# EAGLE design HelloBoardFinal (EAGLE 9.6.2)
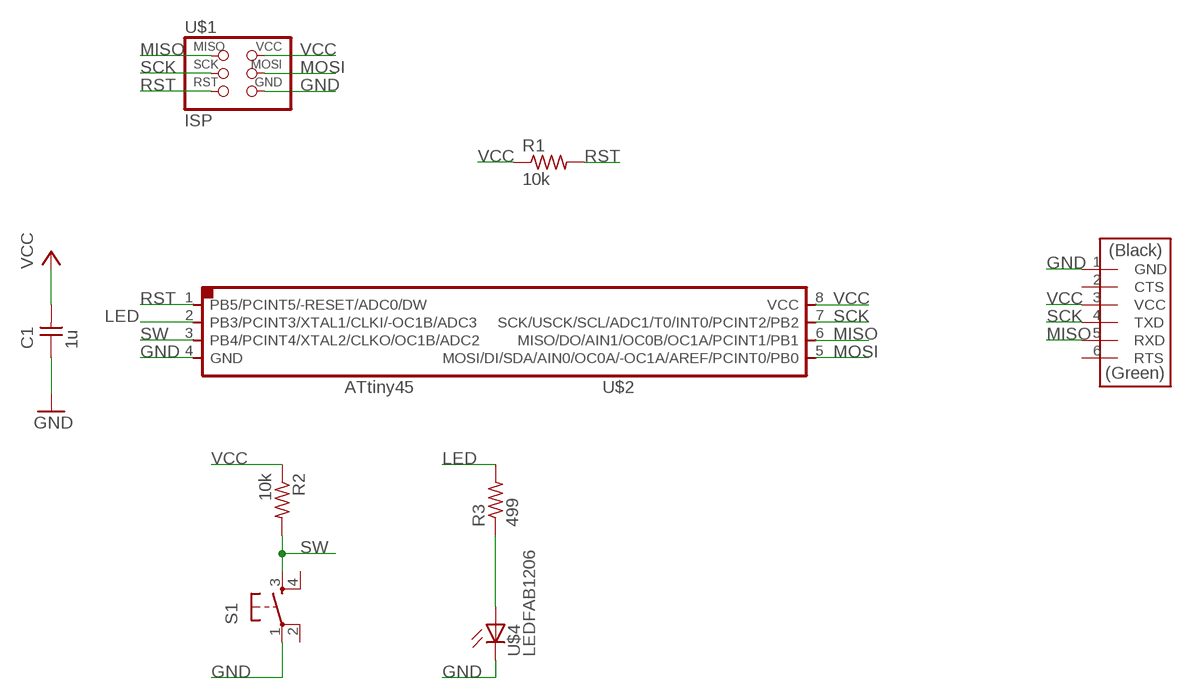
[diagram p0: schematic, sheet 1]

## Parts
C1  1u  CAP_UNPOLARIZEDFAB  [C1206FAB]
R1  10k  R1206FAB  [R1206FAB]
R2  10k  R1206FAB  [R1206FAB]
R3  499  R1206FAB  [R1206FAB]
S1  SW_SWITCH_TACTILE_6MM6MM_SWITCH  [6MM_SWITCH]
U$1  ISP  CONN_03X2_AVRISPSMD  [2X03SMD]
U$2  AT45  UC_ATTINY45SI  [SOIC8]
U$3  CONN_06_FTDI-SMD-HEADER  [1X06SMD]
U$4  LEDFAB1206  [LED1206FAB]

## Nets
GND: C1.1 S1.1(P) U$1.6(GND) U$2.4(GND) U$3.1(GND) U$4.2(C)
LED: R3.2 U$2.2(PB3/PCINT3/XTAL1/CLKI/-OC1B/ADC3)
MISO: U$1.1(MISO) U$2.6(MISO/DO/AIN1/OC0B/OC1A/PCINT1/PB1) U$3.5(RXD)
MOSI: U$1.4(MOSI) U$2.5(MOSI/DI/SDA/AIN0/OC0A/-OC1A/AREF/PCINT0/PB0)
N$2: R3.1 U$4.1(A)
RST: R1.2 U$1.5(RST) U$2.1(PB5/PCINT5/-RESET/ADC0/DW)
SCK: U$1.3(SCK) U$2.7(SCK/USCK/SCL/ADC1/T0/INT0/PCINT2/PB2) U$3.4(TXD)
SW: R2.2 S1.3(S) U$2.3(PB4/PCINT4/XTAL2/CLKO/OC1B/ADC2)
VCC: C1.2 R1.1 R2.1 U$1.2(VCC) U$2.8(VCC) U$3.3(VCC)
Unconnected: S1.2(P1) S1.4(S1) U$3.2(CTS) U$3.6(RTS)

## Library data of the parts
C1 = 00fab:CAP_UNPOLARIZED
R1-R3 = 00fab:R: Resistor (US Symbol) Variants with postfix FAB are widened to allow the routing of internal traces
S1 = 00fab:SW_SWITCH_TACTILE_6MM: OMRON SWITCH
U$1 = 00fab:CONN_03X2_AVRISP
U$2 = 00fab:UC_ATTINY45
U$3 = 00fab:CONN_06_FTDI-SMD-HEADER
U$4 = 00fab:LED: LED

## Board
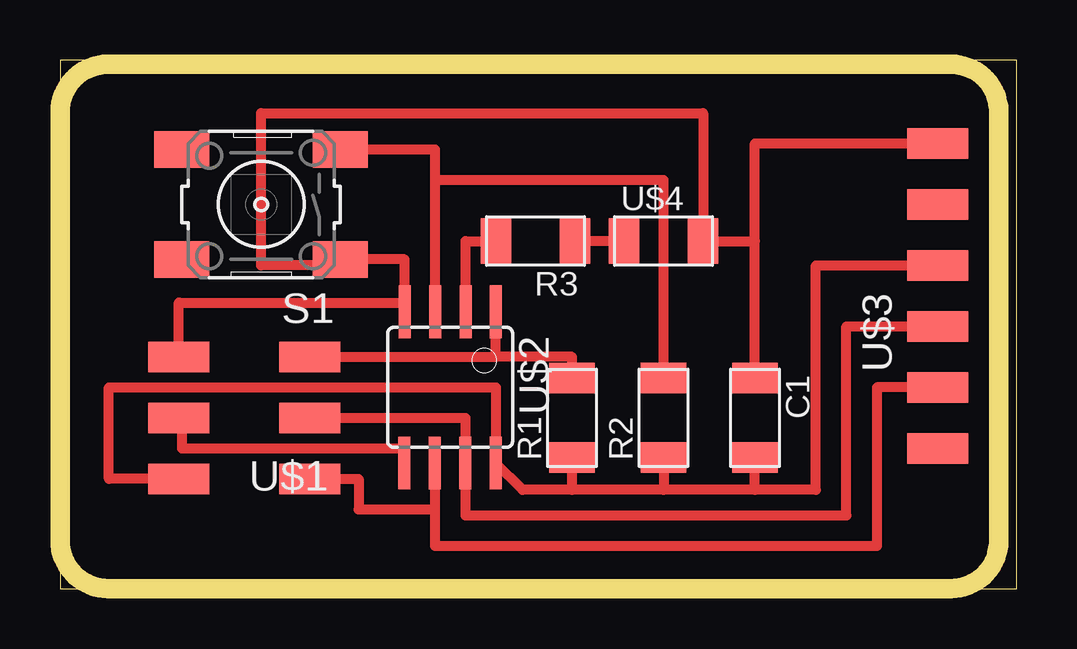
[diagram p1: board, top side]

Size 39.86 x 22.02 mm. Coordinates in mm from the lower left corner, seen from the top.
Outline: 0,0 39.86,0 39.86,22.02 0,22.02 0,0
Copper layers (1*16): Top 0.035mm / dielectric 1.5mm / Bottom 0.035mm
Design rules "default *": minimum track width 16mil, minimum drill 0.35mm, track to track 16mil, track to pad 16mil, pad to pad 16mil, via to via 16mil, smd to smd 10mil, copper to edge 40mil, drill to drill 6mil, minimum pad ring 10mil, minimum via ring 8mil, stop-mask expansion 4mil, vias tented up to drill 0mil, thermal gap 10mil
Milling: 8 lines

### Footprints (pad centres in the part's own frame; a part is rotated, then mirrored left to right if it is on the bottom)
C1206FAB = smd 1.27 x 1.905: 1 -1.651,0; 2 1.651,0
R1206FAB = smd 1.27 x 1.905: 1 -1.651,0; 2 1.651,0
6MM_SWITCH = smd 2.286 x 1.524: 1 -3.302,2.286; 2 3.302,2.286; 3 -3.302,-2.286; 4 3.302,-2.286
2X03SMD = smd 2.54 x 1.27: 1 -2.54,2.54; 2 2.92,2.54; 3 -2.54,0; 4 2.92,0; 5 -2.54,-2.54; 6 2.92,-2.54
SOIC8 = smd 0.5 x 2.2: 1 -1.905,-3.154; 2 -0.645,-3.154; 3 0.625,-3.154; 4 1.895,-3.154; 5 1.905,3.154; 6 0.635,3.154; 7 -0.635,3.154; 8 -1.905,3.154
1X06SMD = smd 2.54 x 1.27: 1 0,6.35; 2 0,3.81; 3 0,1.27; 4 0,-1.27; 5 0,-3.81; 6 0,-6.35
LED1206FAB = smd 1.27 x 1.905: 1 -1.651,0; 2 1.651,0

### Placement (x,y rotation side)
C1  28.96,7.11 270 top
R1  21.34,7.11 90 top
R2  25.15,7.11 90 top
R3  19.81,14.48 180 top
S1  8.38,16 180 top
U$1  7.87,7.11 180 top
U$2  16.26,8.38 180 top
U$3  36.58,12.19 0 top
U$4  25.15,14.48 0 top

### Tracks (layer width: path | path; a pad name or v marks a point on that pad's centre or on a via)
GND
  Top 0.406: U$1.6 4.95,11.91 14.36,11.91 U$2.4 14.36,13.72 S1.1 11.68,13.46 8.38,13.46 8.38,19.81 26.8,19.81 U$4.2 28.96,14.48 | C1.1 28.96,14.48 | 28.96,14.48 28.96,18.54 U$3.1
LED
  Top 0.406: R3.2 16.9,14.48 U$2.2
MISO
  Top 0.406: U$3.5 34.04,8.38 34.04,1.78 15.62,1.78 15.62,3.3 | U$1.1 12.45,4.57 12.45,3.3 15.62,3.3 | U$2.6 15.62,3.3
MOSI
  Top 0.406: U$2.5 14.35,5.84 5.08,5.84 5.08,6.99 U$1.4
N$2
  Top 0.406: U$4.1 R3.1
RST
  Top 0.406: U$1.5 18.16,9.65 | 18.16,9.65 U$2.1 | R1.2 21.34,9.65 18.16,9.65
SCK
  Top 0.406: U$1.3 16.89,7.11 U$2.7 16.89,3.05 32.77,3.05 32.77,10.92 U$3.4
SW
  Top 0.406: R2.2 25.15,17.02 15.63,17.02 | S1.3 15.63,18.29 15.63,17.02 | U$2.3 15.63,17.02
VCC
  Top 0.406: U$1.2 2.03,4.57 2.03,8.38 18.16,8.38 U$2.8 19.27,4.12 21.34,4.12 | U$3.3 31.5,13.46 31.5,4.12 28.96,4.12 | 28.96,4.12 25.15,4.12 | 25.15,4.12 21.34,4.12 | 21.34,4.12 R1.1 | 28.96,4.12 C1.2 | R2.1 25.15,4.12